# EasyEDA Pro project ProProject_Access Control Bypass Plug_2024-06-07.epro

# Schematic V2.0.1 Schematic
Create Date: 2024-06-07; Page Name: Main Page.V2.0.1 Schematic; Project Name: Access Control Bypass Plug; Schematic Name: V2.0.1 Schematic; Update Date: 2024-06-07; Company: RIT SHED MAKERSPACE; Drawn: Jim Heaney; Page Size: A4; Part Number: JLCPCB-002; Reviewed: Jim Heaney; Version: V0.1
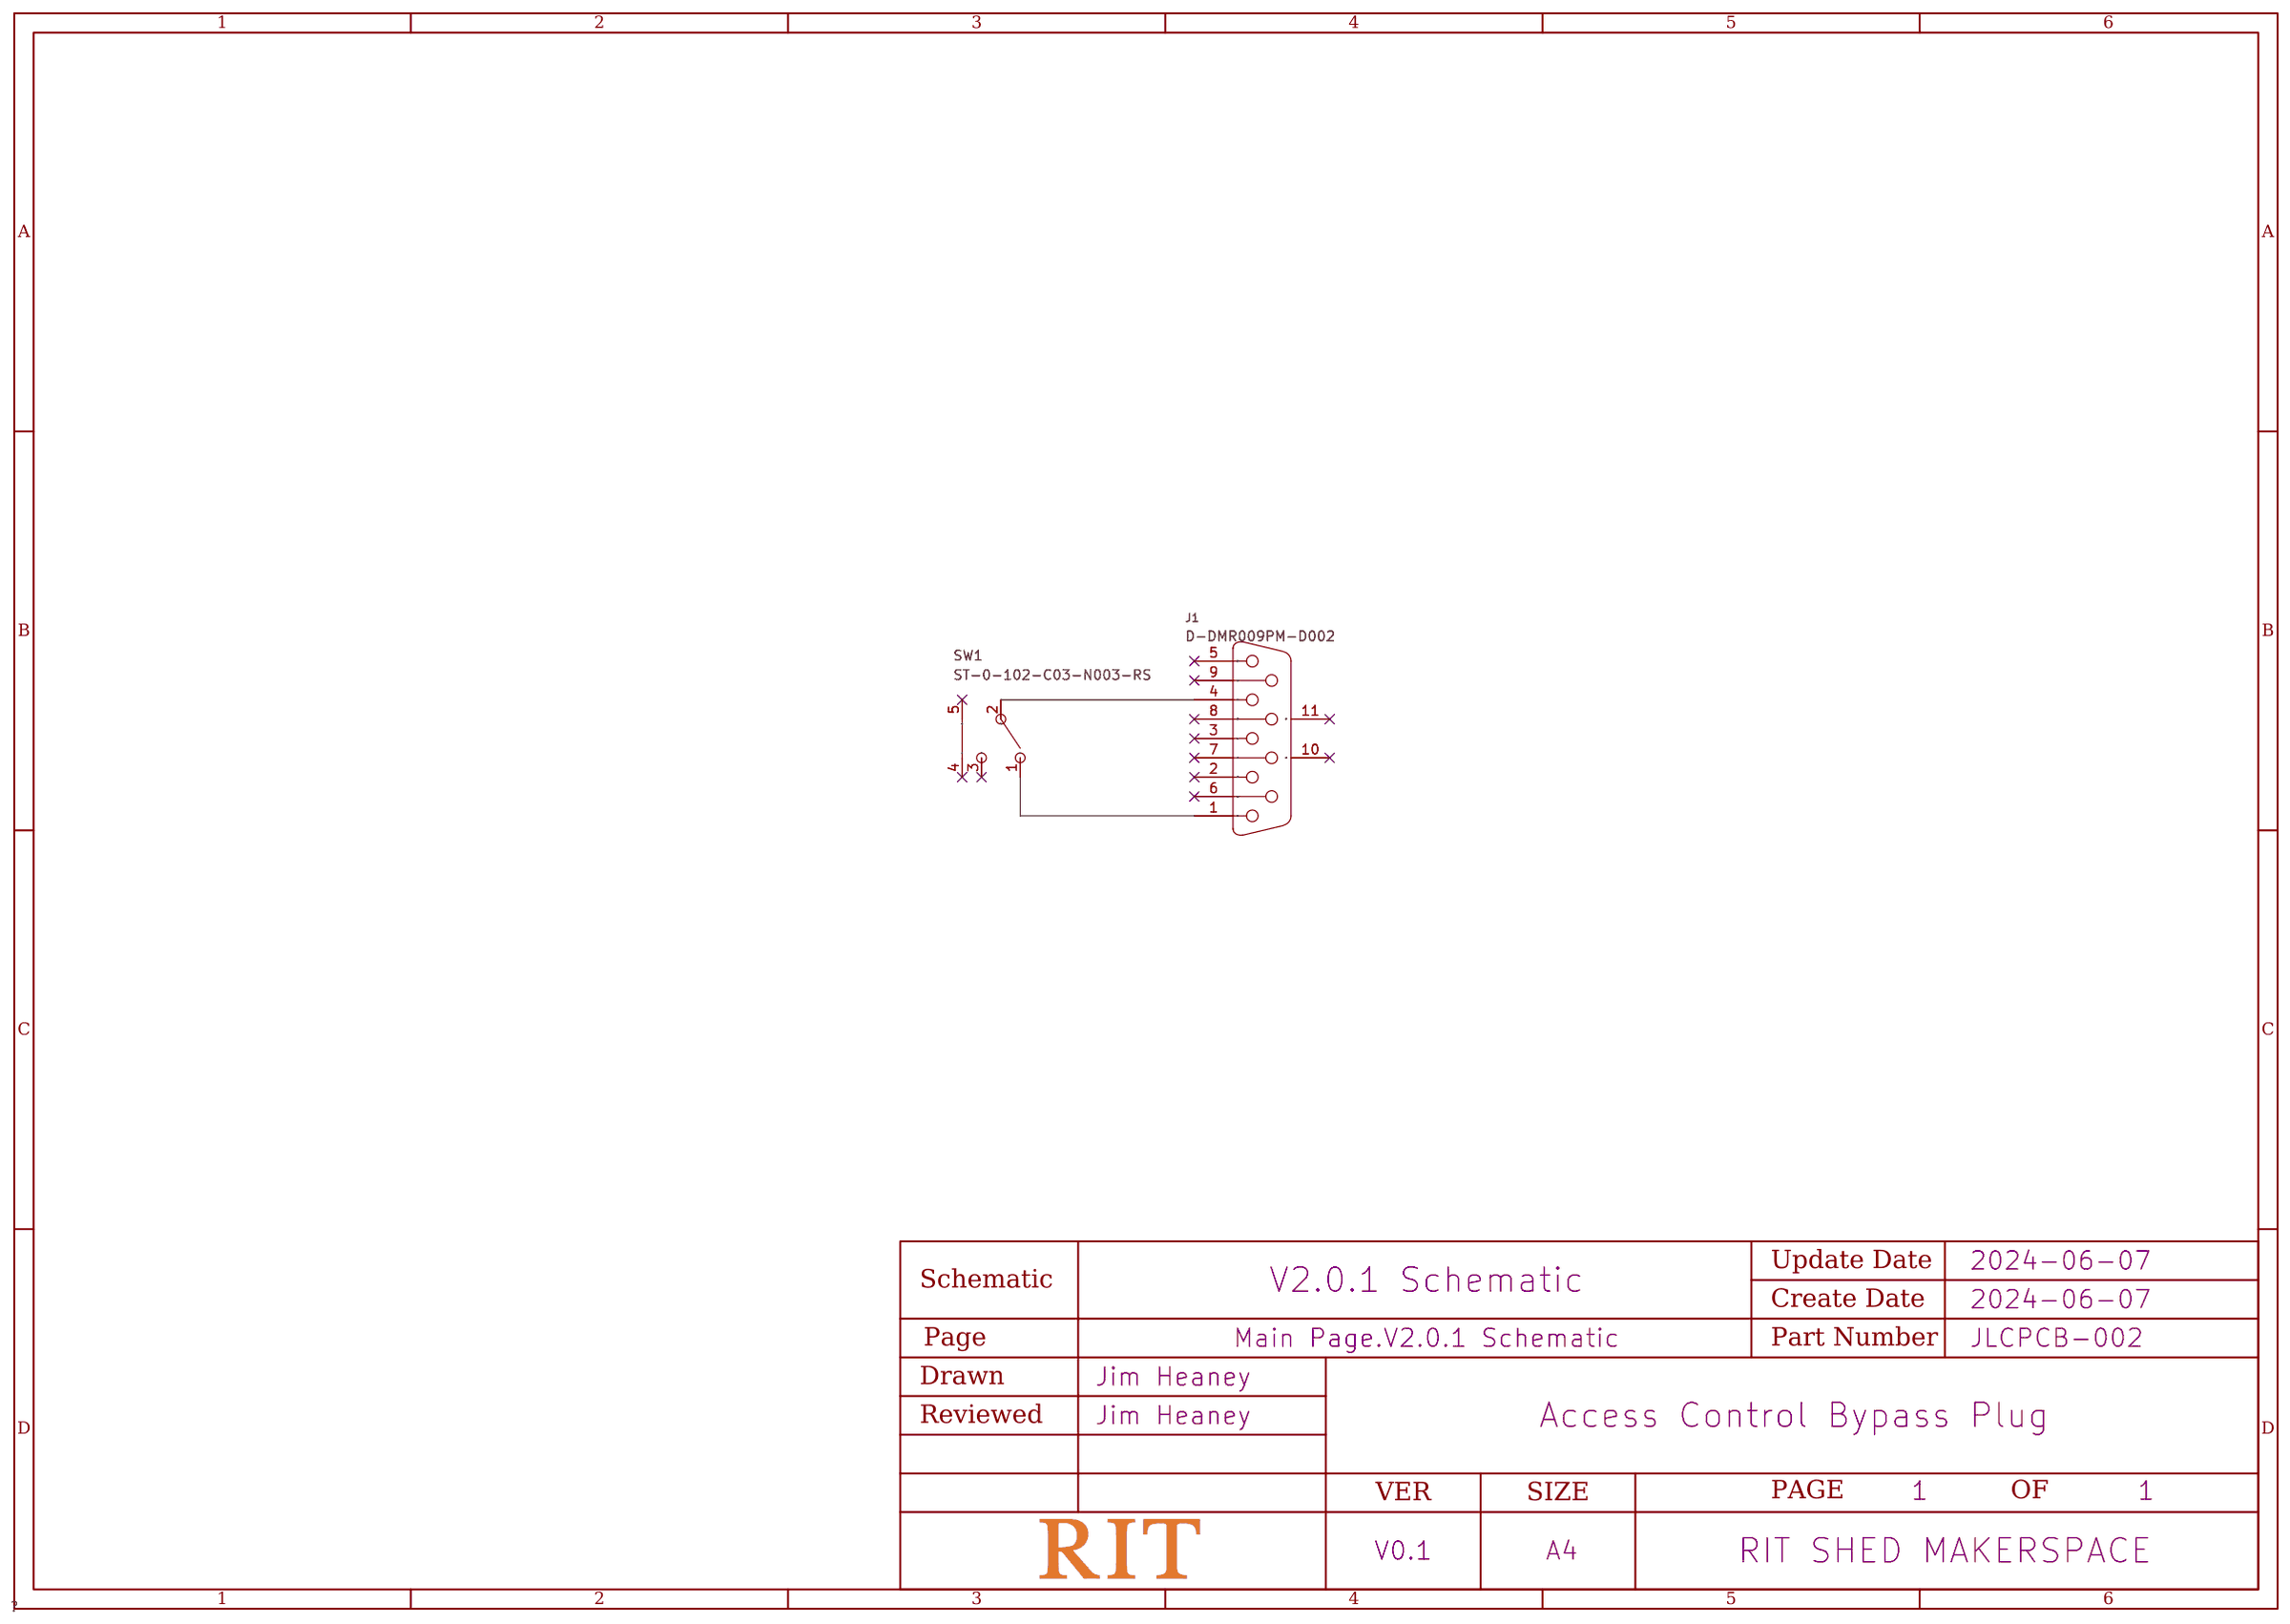
[diagram p0: schematic sheet]

## Parts
J1  D-DMR009PM-D002  [DSUB-TH_DMR-9P]
SW1  ST-0-102-C03-N003-RS  [SW-TH_ST-0-102-C03-N003-RS]

## Library data of the parts
J1 = D-DMR009PM-D002: Connector Type:D-Sub Gender:公 Number of Pins:9P Mounting Style:Right-Angle Number of Rows:2 Current Rating (Max):3A Operating Temperature Range:-50℃~+105℃ Operating Temperature Range:-50℃~+105℃; LCSC Part Name: D-Sub 公 P数:9P; Supplier Part: C141880; Manufacturer: Ckmtw(灿科盟); Supplier Footprint: 弯插; JLCPCB Part Class: Extended Part; Datasheet: https://atta.szlcsc.com/upload/public/pdf/source/20171123/C141880_15114109678101137623.pdf; Supplier: LCSC; Connector Type: D-Sub; Gender: 公; Number of Pins: 9P; Mounting Style: Right-Angle; Number of Rows: 2; Current Rating (Max): 3A; Operating Temperature Range: -50℃~+105℃
SW1 = ST-0-102-C03-N003-RS: Circuit:SPDT Mechanical Life:4万次 With Lamp:- Contact Current:3A Voltage Rating (AC):125V Voltage Rating (DC):- Actuator Type:Cylindrical button handle Pin Style:PCPin Mounting Style:- Operating Temperature:-25℃~+85℃ Operating Temperature:-25℃~+85℃; LCSC Part Name: 超小型钮子三脚二档(正弯脚); Supplier Part: C1788489; Manufacturer: YUEN FUNG(源丰); Supplier Footprint: 插件; JLCPCB Part Class: Extended Part; Datasheet: https://atta.szlcsc.com/upload/public/pdf/source/20201225/C1788489_FC77DF1FE334E292D58BD8615B26DB83.pdf; Supplier: LCSC; Circuit: SPDT; Mechanical Life: 4万次; Contact Current: 3A; Voltage Rating (AC): 125V; Actuator Type: Cylindrical button handle; Pin Style: PCPin; Operating Temperature: -25℃~+85℃

## Nets
Net-(J1-4): J1.4 SW1.5

Not connected (* = marked no-connect by the designer): J1 1 2* 3* 5* 6* 7* 8* 9* 10(MH1)* 11(MH2)*; SW1 1 2 3* 4*

# Board V2.0.1 PCB
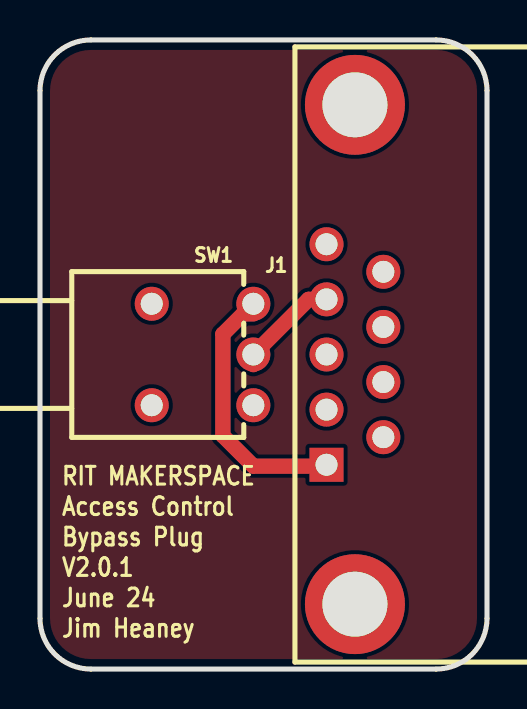
[diagram p1: board, top side]
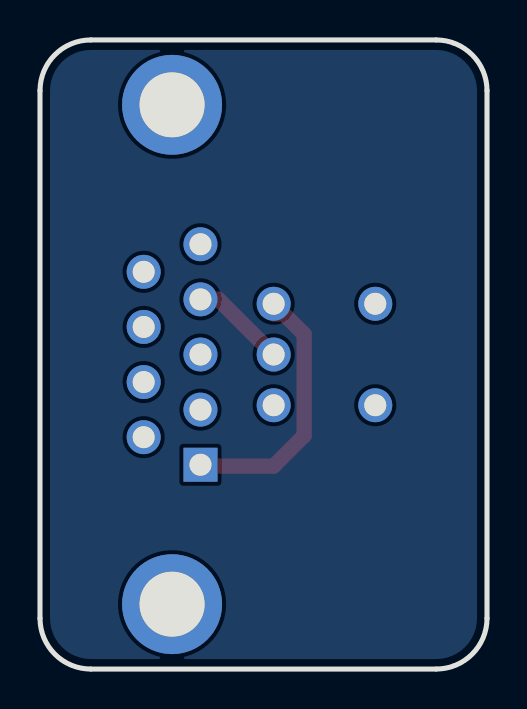
[diagram p2: board, bottom side, seen from below]

Outline 22.35 x 31.5 mm; copper layers: Top Layer, Bottom Layer. Coordinates in mm from the lower left corner of the outline.
Outline path: 0,28.96 0,2.54 arc(0.74,0.74) 2.54,0 19.81,0 arc(21.61,0.74) 22.35,2.54 22.35,28.96 arc(21.61,30.75) 19.81,31.5 2.54,31.5 arc(0.74,30.75) 0,28.96
Stack: Top Layer 0.035mm / Dielectric1 1.51mm FR4 er 4.5 / Bottom Layer 0.035mm

## Design rules (mm)
template: JLCPCB Capability(Two Layers Board)
spacing copperThickness1oz (default): track to track 0.102, other pairs 0.152 to 0.3
spacing copperThickness2oz: track to track 0.203, other pairs 0.152 to 0.3
track width copperThickness1oz (default): min 0.127, default 0.254, max 2.54
track width copperThickness2oz: min 0.203, default 0.254, max 2.54
differential pair differentialPair (default): width min 0.127, default 0.254, max 2.54; gap min 0.152, default 0.152
via viaSize (default): diameter min 0.5, default 0.61, max 10; hole min 0.3, default 0.305, max 6.3

## Placement (name value [footprint] x y rotation side)
J1  D-DMR009PM-D002  [DSUB-TH_DMR-9P]  15.75 15.75 0 top
SW1  ST-0-102-C03-N003-RS  [SW-TH_ST-0-102-C03-N003-RS]  8.13 15.75 270 top

## Footprints (pads in the part's own frame, mm; a bottom-side part is the same pattern mirrored in y, then rotated)
DSUB-TH_DMR-9P
  rect 1.7x1.7 hole 1.1: 1(-1.42,-5.52)
  round 1.7 hole 1.1: 2(-1.42,-2.76) 3(-1.42,0) 4(-1.42,2.76) 5(-1.42,5.52) 6(1.42,-4.14) 7(1.42,-1.38) 8(1.42,1.38) 9(1.42,4.14)
  round 5 hole 3.25: 10(0,12.5) 11(0,-12.5)
SW-TH_ST-0-102-C03-N003-RS
  round 1.7 hole 1.1: 1(-2.54,2.54) 2(0,2.54) 3(2.54,2.54) 4(2.54,-2.54) 5(-2.54,-2.54)

## Nets
$1N162: J1.4 SW1.2
$1N168: J1.1 SW1.1

Pads without a net: J1 2 3 5 6 7 8 9 10 11; SW1 3 4 5

## Routing (per net, layer and track width the routed paths; a pad name or vN(x,y) marks a point on that pad's centre or on a via; arc(x,y) is an arc through that point)
$1N162: length 5.3
  Top Layer w0.762: J1.4 13.43,18.51 SW1.2 10.67,15.24
$1N168: length 12.9
  Top Layer w0.762: J1.1 14.26,10.16 10.67,10.16 9.14,11.68 9.14,16.76 10.16,17.78 10.67,17.78

## Copper pours and planes (outline as drawn; the poured copper is in the pictures)
STEAL on Top Layer: -0.51,32.51 22.86,32.51 22.86,-0.51 -0.51,-0.51
STEAL2 on Bottom Layer: -0.51,32.51 22.86,32.51 22.86,-0.51 -0.51,-0.51

## Text on the board
Top Silkscreen Layer: Access Control | Bypass Plug | V2.0.1 | June 24 | Jim Heaney | RIT MAKERSPACE
